# Altium schematic sheet Powerbank_schematic.SchDoc
size A4
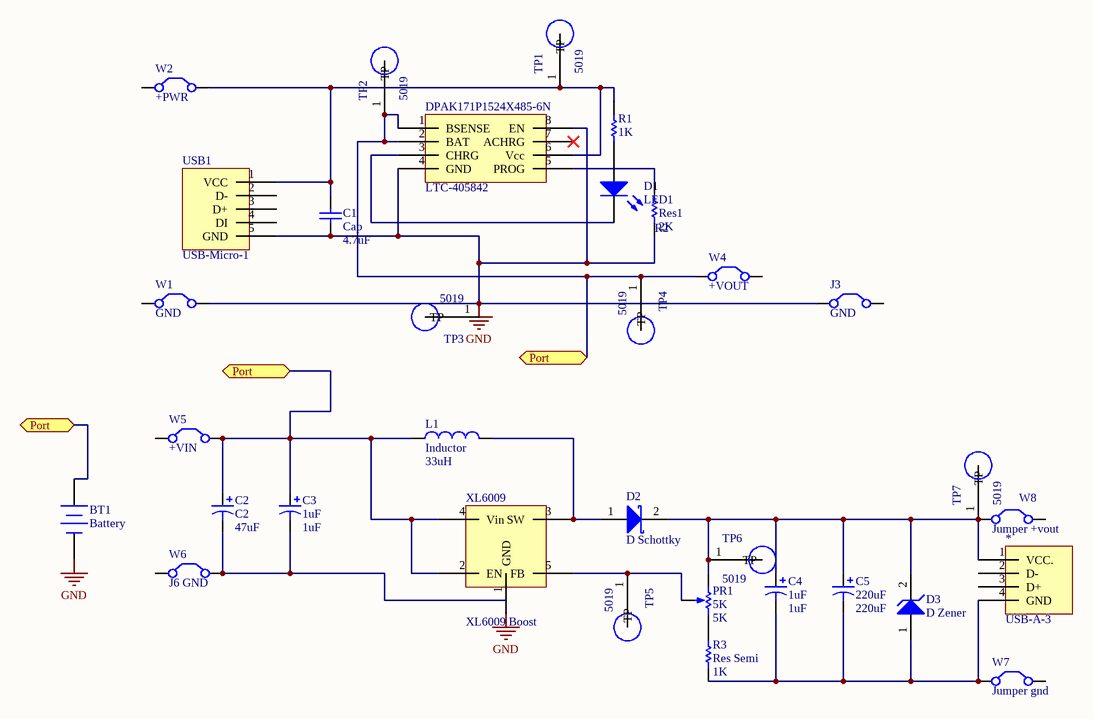
[diagram p0: Powerbank_schematic.SchDoc]

## Parts
*  USB-A-3  [USB3]
BT1  Battery  [BAT-2]
C1  Cap  value 4.7uF  [RAD-0.3]
C2  C2  value 47uF  [C0805]
C3  1uF  [C0805]
C4  1uF  [C0805]
C5  220uF  [C0805]
D1  LED1  [LED-1]
D2  D Schottky  [SMB]
D3  D Zener  [DIODE-0.7]
DPAK171P1524X485-6N  LTC-405842  [DFN-8_DD]
J3  GND  [RAD-0.2]
L1  Inductor  value 33uH  [0402-A]
PR1  5K  [VR5]
R1  value 1K  [AXIAL-0.5]  (hidden comment: Res Semi)
R2  Res1  value 2K  [AXIAL-0.3]
R3  Res Semi  value 1K  [AXIAL-0.5]
TP1  5019  [TP380X203]
TP2  5019  [TP380X203]
TP3  5019  [TP380X203]
TP4  5019  [TP380X203]
TP5  5019  [TP380X203]
TP6  5019  [TP380X203]
TP7  5019  [TP380X203]
USB1  USB-Micro-1  [USB_Micro1]
W1  GND  [RAD-0.2]
W2  +PWR  [RAD-0.2]
W4  +VOUT  [RAD-0.2]
W5  +VIN  [RAD-0.2]
W6  J6 GND  [RAD-0.2]
W7  Jumper gnd  [RAD-0.2]
W8  Jumper +vout  [RAD-0.2]
XL6009  XL6009 Boost  [DPAK171P1524X485-6N]

## Ports
Port

## Nets
GND: BT1.2(-) C1.1 DPAK171P1524X485-6N.4(GND) DPAK171P1524X485-6N.8(EN) J3.1(C1) R2.1 USB1.5(GND) W1.2(C2) XL6009.1(GND)
Port: BT1.1(+) C2.1 C3.1 DPAK171P1524X485-6N.1(BSENSE) DPAK171P1524X485-6N.2(BAT) L1.1 TP2.1(TP) TP4.1(TP) W4.1(C1) W5.2(C2) XL6009.2(EN) XL6009.4(Vin) ; port Port
Net*_1: *.1(VCC.) C4.1 C5.1 D2.2(K) D3.2(K) PR1.1(TOP) TP6.1(TP) TP7.1(TP) W8.1(C1)
Net*_4: *.4(GND) C4.2 C5.2 D3.1(A) R3.1 W7.1(C1)
NetC1_2: C1.2 DPAK171P1524X485-6N.6(Vcc) R1.1 TP1.1(TP) USB1.1(VCC) W2.2(C2)
NetC2_2: C2.2 C3.2 W6.2(C2)
NetD1_1: D1.1(A) R1.2
NetD1_2: D1.2(K) DPAK171P1524X485-6N.3(CHRG)
NetD2_1: D2.1(A) L1.2 XL6009.3(SW)
NetDPAK171P1524X485-6N_5: DPAK171P1524X485-6N.5(PROG) R2.2
NetPR1_2: PR1.2(BOT) R3.2
NetPR1_3: PR1.3(TAP) TP5.1(TP) XL6009.5(FB)

Not connected (* = marked no-connect by the designer): * 2(D-) 3(D+); DPAK171P1524X485-6N 7(ACHRG)*; J3 2(C2); TP3 1(TP); USB1 2(D-) 3(D+) 4(DI); W1 1(C1); W2 1(C1); W4 2(C2); W5 1(C1); W6 1(C1); W7 2(C2); W8 2(C2)

## Library data of the parts
BT1 = Battery: Multicell Battery; Published: 24-Mar-1999; LatestRevisionDate: 17-Jul-2002; LatestRevisionNote: Re-released for DXP Platform.; PackageReference: BAT-2; Publisher: Altium Limited; PackageDescription: Battery; 2 Leads
C1 = Cap: Capacitor; Published: 8-Jun-2000; LatestRevisionDate: 17-Jul-2002; LatestRevisionNote: Re-released for DXP Platform.; PackageReference: RAD-0.3; Publisher: Altium Limited; PackageDescription: Radial Cap, Thru-Hole; 2 Leads; 0.3 in Pin Spacing
C2-C5 = Cap Pol3: Polarized Capacitor (Surface Mount); Published: 8-Jun-2000; LatestRevisionDate: 29-May-2009; LatestRevisionNote: IPC-7351 Footprint Added.; PackageReference: C0805; Publisher: Altium Limited; PackageDescription: Chip Capacitor
  C3 C4: Value: 1uF
  C5: Value: 220uF
D1 = LED1: Typical RED GaAs LED; Published: 8-Jun-2000; LatestRevisionDate: 08-Jul-2005; LatestRevisionNote: Mech Layer 1 removed.; PackageReference: LED-1; Publisher: Altium Limited; PackageDescription: LED; 2 Leads
D2 = D Schottky: Schottky Diode; Published: 8-Jun-2000; LatestRevisionDate: 17-Jul-2002; LatestRevisionNote: Re-released for DXP Platform.; PackageReference: SMB; Publisher: Altium Limited; PackageDescription: DO-214-AA/SMB; 2 C-Bend Leads; Body 5.3 x 3.6 mm, inc. leads (LxW); Code_JEDEC: DO-214-AA
D3 = D Zener: Zener Diode; Published: 8-Jun-2000; LatestRevisionDate: 17-Jul-2002; LatestRevisionNote: Re-released for DXP Platform.; PackageReference: DIODE-0.7; Publisher: Altium Limited; PackageDescription: Diode, Thru-Hole; 2 Leads; 0.7 in Pin Spacing
J3 W1 W2 W4-W8 = Jumper: Jumper Wire; Published: 24-Mar-1999; LatestRevisionDate: 17-Jul-2002; LatestRevisionNote: Re-released for DXP Platform.; PackageReference: RAD-0.2; Publisher: Altium Limited; PackageDescription: Radial Cap, Thru-Hole; 2 Leads; 0.2 in Pin Spacing
L1 = Inductor: Code_IEC: 1005; Published: 8-Jun-2000; LatestRevisionDate: 29-May-2009; LatestRevisionNote: IPC-7351 Footprint Added.; PackageReference: 0402-A; Publisher: Altium Limited; PackageDescription: Chip Inductor; Code_JEITA: 0402
PR1 = RPot: Potentiometer; Sim Note: Enter the Resistance value and the set point into parameter fields.; Set Position: 0.5; Published: 8-Jun-2000; LatestRevisionDate: 17-Jul-2002; LatestRevisionNote: Re-released for DXP Platform.; PackageReference: VR5; Publisher: Altium Limited; PackageDescription: Variable Resistor, Thru-Hole; 3 Leads; Value: 5K
R1 R3 = Res Semi: Semiconductor Resistor; Published: 8-Jun-2000; LatestRevisionDate: 17-Jul-2002; LatestRevisionNote: Re-released for DXP Platform.; PackageReference: AXIAL-0.5; Publisher: Altium Limited; PackageDescription: Axial Device, Thru-Hole; 2 Leads; 0.5 in Pin Spacing
R2 = Res1: Resistor; Published: 8-Jun-2000; LatestRevisionDate: 17-Jul-2002; LatestRevisionNote: Re-released for DXP Platform.; PackageReference: AXIAL-0.3; Publisher: Altium Limited; PackageDescription: Axial Device, Thru-Hole; 2 Leads; 0.3 in Pin Spacing
TP1-TP7 = 5019: PC TEST POINT MINI SMD; MF: Keystone; Package: None; Price: 0.18 USD; Availability: Good; MP: 5019; Value: *